# Altium project 18111A_Ticketing.PrjPcb
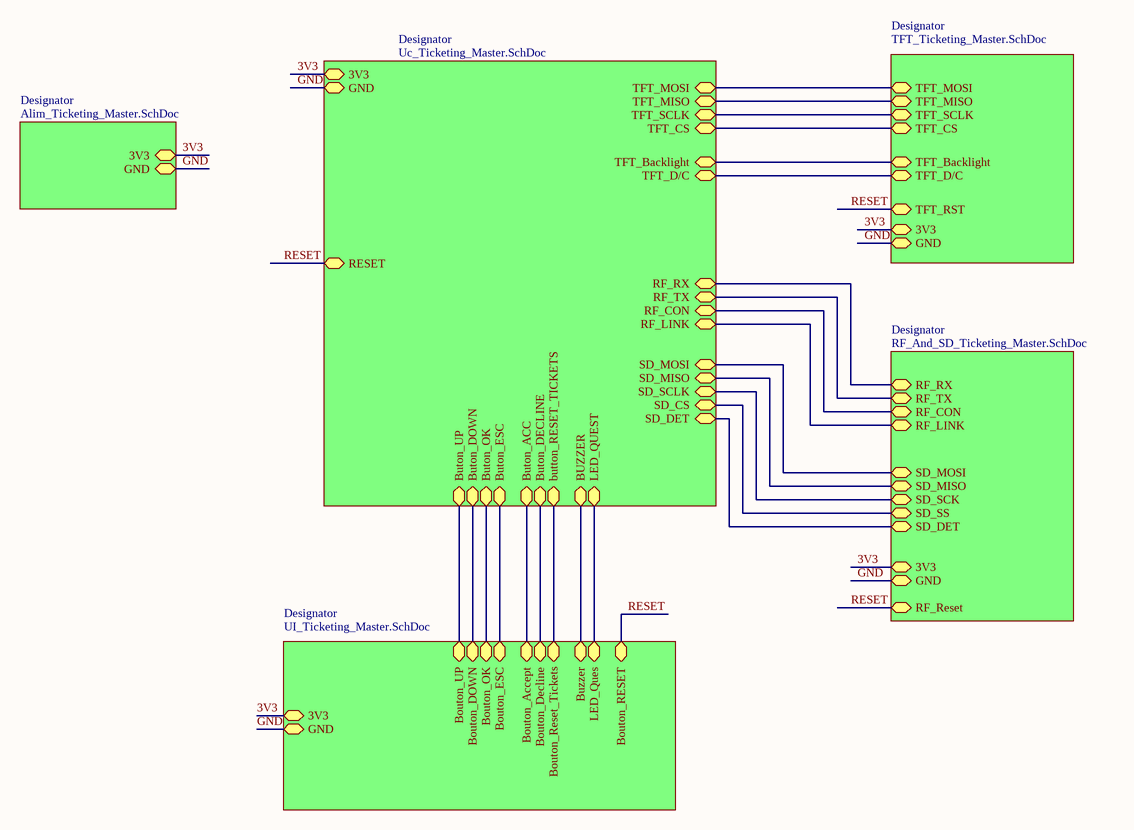
[diagram p0: Ticketing_Master.SchDoc]
6 sheets, 58 parts. Net scope: hierarchical (ports join the sheet entries above them; power ports are global).
Board file: PCB_Ticketing_Master.PcbDoc
Sheets:
  Ticketing_Master.SchDoc
    Designator = Alim_Ticketing_Master.SchDoc
    Designator = RF_And_SD_Ticketing_Master.SchDoc
    Designator = TFT_Ticketing_Master.SchDoc
    Designator = Uc_Ticketing_Master.SchDoc
    Designator = UI_Ticketing_Master.SchDoc

## Sheet Ticketing_Master.SchDoc
size A4; Organization: ETML-ES; Address1: Avenue Recordon 1; Address2: 1004 Lausanne; Address3: Switzerland

### Sub-sheets
Designator = Alim_Ticketing_Master.SchDoc: 3V3, GND
Designator = RF_And_SD_Ticketing_Master.SchDoc: RF_RX, RF_TX, SD_MISO, RF_Reset, SD_SS, SD_MOSI, SD_SCK, RF_CON, RF_LINK, GND, 3V3, SD_DET
Designator = TFT_Ticketing_Master.SchDoc: TFT_MOSI, TFT_Backlight, TFT_CS, TFT_RST, TFT_D/C, TFT_MISO, TFT_SCLK, 3V3, GND
Designator = Uc_Ticketing_Master.SchDoc: 3V3, GND, SD_SCLK, TFT_SCLK, SD_MOSI, SD_MISO, RF_RX, RF_TX, TFT_MOSI, TFT_MISO, TFT_Backlight, SD_CS, TFT_CS, TFT_D/C, RF_CON, RF_LINK, Buton_UP, Buton_OK, Buton_ESC, Buton_DOWN, LED_QUEST, BUZZER, Buton_DECLINE, button_RESET_TICKETS, Buton_ACC, RESET, SD_DET
Designator = UI_Ticketing_Master.SchDoc: GND, 3V3, Buzzer, Bouton_Accept, Bouton_UP, Bouton_OK, LED_Ques, Bouton_ESC, Bouton_Decline, Bouton_Reset_Tickets, Bouton_DOWN, Bouton_RESET

### Nets
3V3: sheet Designator/3V3, sheet Designator/3V3, sheet Designator/3V3, sheet Designator/3V3, sheet Designator/3V3
GND: sheet Designator/GND, sheet Designator/GND, sheet Designator/GND, sheet Designator/GND, sheet Designator/GND
BackLight: sheet Designator/TFT_Backlight, sheet Designator/TFT_Backlight
Connect(M): sheet Designator/RF_CON, sheet Designator/RF_CON
CS: sheet Designator/TFT_CS, sheet Designator/TFT_CS
D/C: sheet Designator/TFT_D/C, sheet Designator/TFT_D/C
LED_Ques: sheet Designator/LED_QUEST, sheet Designator/LED_Ques
LINK(M): sheet Designator/RF_LINK, sheet Designator/RF_LINK
MISO: sheet Designator/TFT_MISO, sheet Designator/TFT_MISO
MOSI: sheet Designator/TFT_MOSI, sheet Designator/TFT_MOSI
RESET: sheet Designator/RF_Reset, sheet Designator/TFT_RST, sheet Designator/RESET, sheet Designator/Bouton_RESET
SCLK: sheet Designator/TFT_SCLK, sheet Designator/TFT_SCLK
UART_RX: sheet Designator/RF_RX, sheet Designator/RF_RX
UART_TX: sheet Designator/RF_TX, sheet Designator/RF_TX
NetJ2_2: sheet Designator/SD_SS, sheet Designator/SD_CS
NetJ2_3: sheet Designator/SD_MOSI, sheet Designator/SD_MOSI
NetJ2_5: sheet Designator/SD_SCK, sheet Designator/SD_SCLK
NetJ2_7: sheet Designator/SD_MISO, sheet Designator/SD_MISO
NetJ2_9: sheet Designator/SD_DET, sheet Designator/SD_DET
NetQ1_1: sheet Designator/BUZZER, sheet Designator/Buzzer
NetR10_1: sheet Designator/Buton_OK, sheet Designator/Bouton_OK
NetR11_1: sheet Designator/Buton_UP, sheet Designator/Bouton_UP
NetR13_1: sheet Designator/Buton_ESC, sheet Designator/Bouton_ESC
NetR14_1: sheet Designator/Buton_DOWN, sheet Designator/Bouton_DOWN
NetR17_1: sheet Designator/Buton_ACC, sheet Designator/Bouton_Accept
NetR18_1: sheet Designator/Buton_DECLINE, sheet Designator/Bouton_Decline
NetR19_1: sheet Designator/button_RESET_TICKETS, sheet Designator/Bouton_Reset_Tickets

### Notes on the sheet
- Fichier :
- Date :
- Heure :
- Projet :
- Auteur :
- Version :
- Chemin :

## Sheet Alim_Ticketing_Master.SchDoc
size A4; Organization: ETML-ES; Address1: Avenue Recordon 1; Address2: 1004 Lausanne; Address3: Switzerland
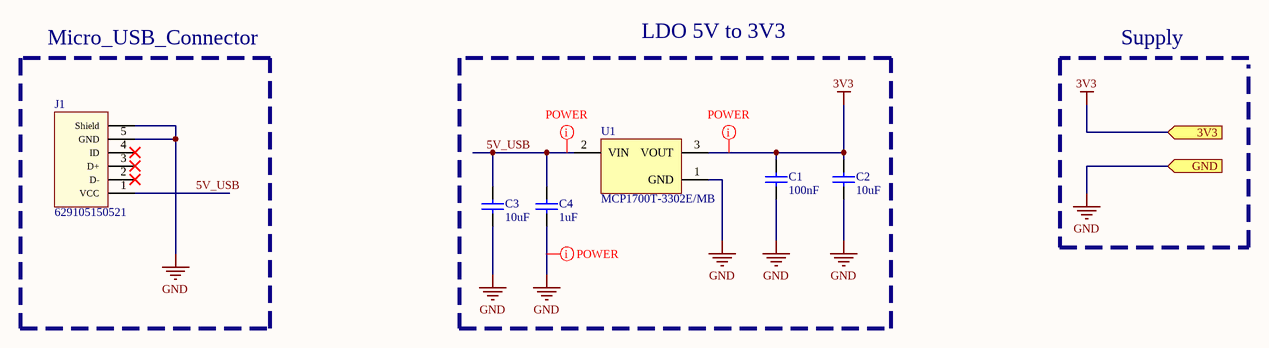
[diagram p1: Alim_Ticketing_Master.SchDoc]

### Parts
C1  100nF  [6-0805_N]
C2  10uF  [6-0805_N]
C3  10uF  [6-0805_N]
C4  1uF  [6-0805_N]
J1  629105150521  [629105150521]
U1  MCP1700T-3302E/MB  [SOT-89-MB3_M]

### Blocks framed on the sheet
Micro_USB_Connector: J1
LDO 5V to 3V3: C1-C4 U1

### Ports
3V3, GND

### Nets
3V3: C1.2 C2.2 U1.3(VOUT) ; port 3V3
GND: C1.1 C2.1 C3.1 C4.1 J1.5(GND) J1.Shell(Shield) U1.1(GND) ; port GND
5V_USB: C3.2 C4.2 J1.1(VCC) U1.2(VIN)

Not connected (* = marked no-connect by the designer): J1 2(D-)* 3(D+)* 4(ID)*

### Layout directives
net class POWER: 3V3, 5V_USB, GND

### Notes on the sheet
- Supply
- Fichier :
- Date :
- Heure :
- Projet :
- Auteur :
- Version :
- Chemin :

### Library data of the parts
C1 = CMP-1036-04401-1: CAP 100nF 16V ±10% 0805 (2012 Metric) Thickness 1.45mm SMD; Case-Metric: 2012; Case-EIA: 0805; Tolerance: Â±10%; Max Thickness: 1.45 mm; Technology: SMT; Value: 100nF; Rated Voltage: 16 V
C2-C4 = CMP-1036-04930-1: CAP 10uF 16V ±20% 0805 (2012 Metric) Thickness 1mm SMD; Case-Metric: 2012; Case-EIA: 0805; Tolerance: Â±20%; Value: 10uF; Rated Voltage: 16 V; Technology: SMT; Max Thickness: 1 mm
J1 = 629105150521: Micro USB 2.0 SMT Type B Horizontal 5 Contacts High Current WR-COM; Interface Type: Type B; Gender: Receptacle; ComponentLink1Description: Manufacturer; ComponentLink1URL: http://www.we-online.de; ComponentLink2Description: Datasheet; ComponentLink2URL: http://katalog.we-online.de/em/datasheet/629105150521.pdf; Part Number: 629105150521; Published Date: April 2017; Publisher: Wurth Elektronik; Sub-Family: Micro USB 2.0; Type: Horizontal; Construction: SMT
U1 = CMP-0136-00812-1: Low Quiescent Current LDO, 3-Pin SOT-89, Extended Temperature, Tape and Reel; PackageDescription: 3-Lead Plastic Small Outline Transistor Header (MB) [SOT-89]; PackageReference: SOT-89-MB3; DatasheetVersion: revB, Feb-2007; Code_IPC: SOT89; PackageVersion: revBB, Aug-2009

## Sheet RF_And_SD_Ticketing_Master.SchDoc
size A4; Organization: ETML-ES; Address1: Avenue Recordon 1; Address2: 1004 Lausanne; Address3: Switzerland
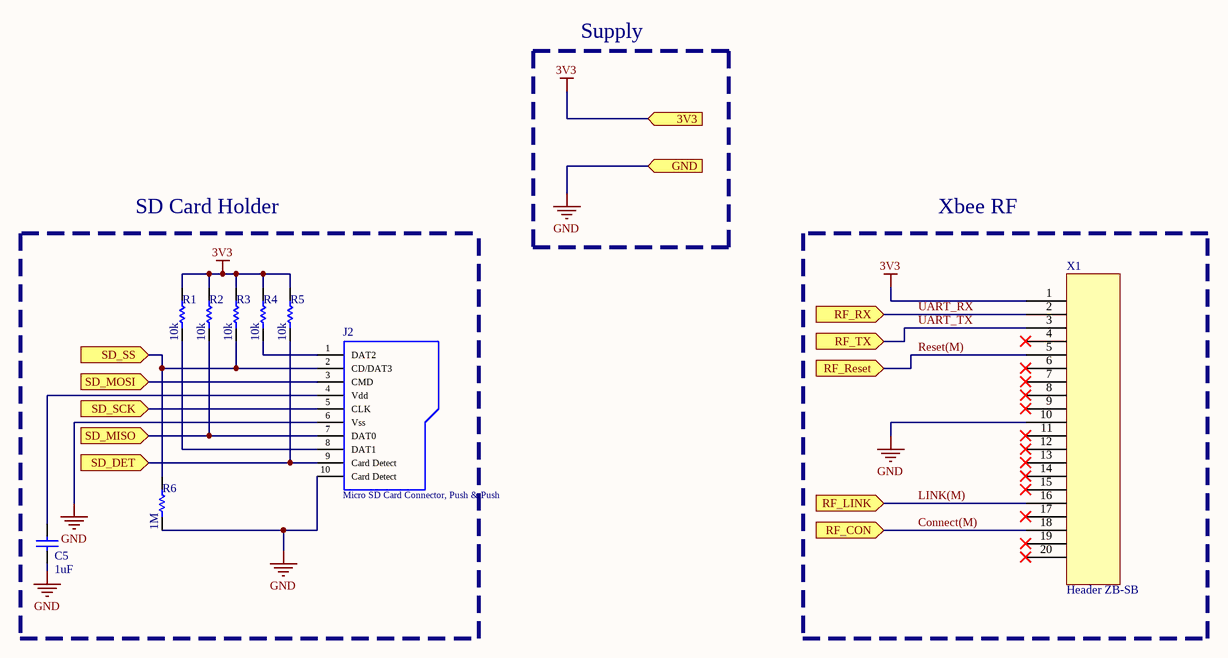
[diagram p2: RF_And_SD_Ticketing_Master.SchDoc]

### Parts
C5  1uF  [6-0805_N]
J2  Micro SD Card Connector, Push & Push  [693071010811]
R1  10k  [RESC0805(2012)_L]
R2  10k  [RESC0805(2012)_L]
R3  10k  [RESC0805(2012)_L]
R4  10k  [RESC0805(2012)_L]
R5  10k  [RESC0805(2012)_L]
R6  1M  [RESC0805(2012)_L]
X1  Header ZB-SB  [ZB-SB]

### Blocks framed on the sheet
Xbee RF: X1

### Ports
3V3, GND, RF_CON, RF_LINK, RF_Reset, RF_RX, RF_TX, SD_DET, SD_MISO, SD_MOSI, SD_SCK, SD_SS

### Nets
3V3: R1.2 R2.2 R3.2 R4.2 R5.2 X1.1 ; port 3V3
GND: C5.1 J2.6(Vss) J2.10(Card_Detect) R6.1 X1.10 ; port GND
Connect(M): X1.18 ; port RF_CON
LINK(M): X1.16 ; port RF_LINK
Reset(M): X1.5 ; port RF_Reset  [project net RESET]
UART_RX: X1.2 ; port RF_RX
UART_TX: X1.3 ; port RF_TX
NetC5_2: C5.2 J2.4(Vdd)
NetJ2_1: J2.1(DAT2) R4.1
NetJ2_2: J2.2(CD/DAT3) R3.1 R6.2 ; port SD_SS
NetJ2_3: J2.3(CMD) ; port SD_MOSI
NetJ2_5: J2.5(CLK) ; port SD_SCK
NetJ2_7: J2.7(DAT0) R2.1 ; port SD_MISO
NetJ2_8: J2.8(DAT1) R1.1
NetJ2_9: J2.9(Card_Detect) R5.1 ; port SD_DET

Not connected (* = marked no-connect by the designer): X1 4* 6* 7* 8* 9* 11* 12* 13* 14* 15* 17* 19* 20*

### Notes on the sheet
- Supply
- SD Card Holder
- Fichier :
- Date :
- Heure :
- Projet :
- Auteur :
- Version :
- Chemin :

### Library data of the parts
C5 = CMP-1036-04930-1: as C2 on sheet Alim_Ticketing_Master; Value: 10uF; Rated Voltage: 16 V; Technology: SMT; Max Thickness: 1 mm
J2 = 693071010811: WR-CRD Micro SD Card Connector, Push & Push, with card detection; Rated Current: 0.5A; Working Voltage: 500V AC; ComponentLink1Description: Manufacturer; ComponentLink1URL: http://www.we-online.de; ComponentLink2Description: Datasheet; ComponentLink2URL: http://katalog.we-online.de/em/datasheet/693071010811.pdf; Part Number: 693071010811; Published Date: Feb. 2018; Publisher: Wurth Elektronik; Operating Temperature: -25 to 85 degC; Mounting Technology: SMT
R1-R6 = CMP-1013-00122-1: 100K 0.125W 5% 0805 (2012 Metric)  SMD; Case-Metric: 2012; Case-EIA: 0805; Tolerance: 5 %; Technology: SMT; Power: 0.125 W
  R1-R5: Value: 10k
  R6: Value: 1M
X1 = HDR ZB-SB 2x10: Header 2x10; PackageCase: XBee; Value: 2x10

## Sheet TFT_Ticketing_Master.SchDoc
size A4; Organization: ETML-ES; Address1: Avenue Recordon 1; Address2: 1004 Lausanne; Address3: Switzerland
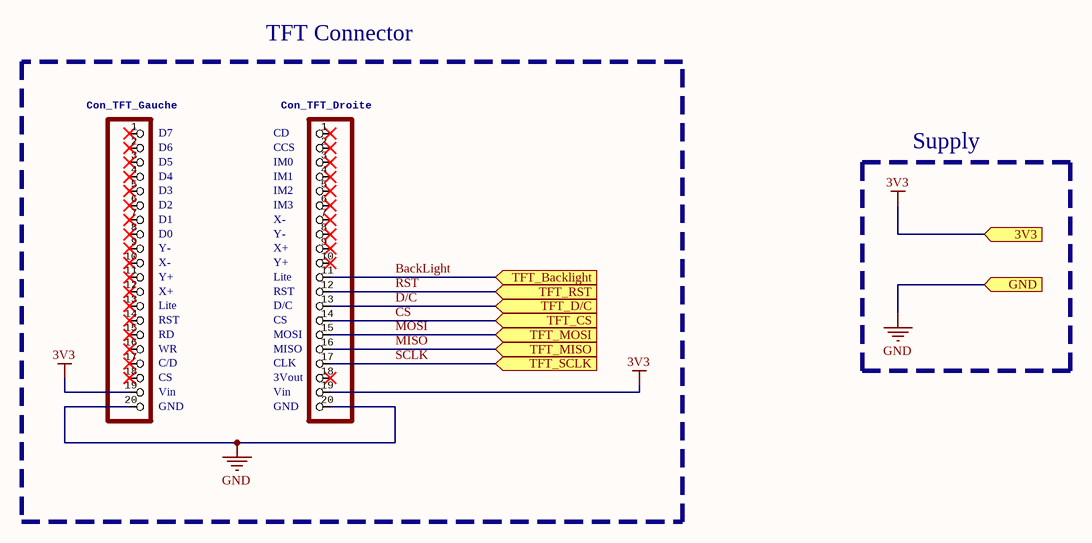
[diagram p3: TFT_Ticketing_Master.SchDoc]

### Parts
Con_TFT_Droite  HEADER-1X20ROUND  [HDR1X20]  (value not drawn)
Con_TFT_Gauche  HEADER-1X20ROUND  [HDR1X20]  (value not drawn)

### Blocks framed on the sheet
TFT Connector: Con_TFT_Droite Con_TFT_Gauche

### Ports
3V3, GND, TFT_Backlight, TFT_CS, TFT_D/C, TFT_MISO, TFT_MOSI, TFT_RST, TFT_SCLK

### Nets
3V3: Con_TFT_Droite.19 Con_TFT_Gauche.19 ; port 3V3
GND: Con_TFT_Droite.20 Con_TFT_Gauche.20 ; port GND
BackLight: Con_TFT_Droite.11 ; port TFT_Backlight
CS: Con_TFT_Droite.14 ; port TFT_CS
D/C: Con_TFT_Droite.13 ; port TFT_D/C
MISO: Con_TFT_Droite.16 ; port TFT_MISO
MOSI: Con_TFT_Droite.15 ; port TFT_MOSI
RST: Con_TFT_Droite.12 ; port TFT_RST  [project net RESET]
SCLK: Con_TFT_Droite.17 ; port TFT_SCLK

Not connected (* = marked no-connect by the designer): Con_TFT_Droite 1* 2* 3* 4* 5* 6* 7* 8* 9* 10* 18*; Con_TFT_Gauche 1* 2* 3* 4* 5* 6* 7* 8* 9* 10* 11* 12* 13* 14* 15* 16* 17* 18*

### Notes on the sheet
- (near Con_TFT_Gauche) D7
- (near Con_TFT_Gauche) D6
- (near Con_TFT_Gauche) D5
- (near Con_TFT_Gauche) D4
- (near Con_TFT_Droite) CD
- (near Con_TFT_Droite) CCS
- (near Con_TFT_Droite) IM0
- (near Con_TFT_Droite) IM1
- Supply
- (near Con_TFT_Gauche) D3
- (near Con_TFT_Gauche) D2
- (near Con_TFT_Gauche) D1
- (near Con_TFT_Gauche) D0
- (near Con_TFT_Gauche) Y-
- (near Con_TFT_Gauche) X-
- (near Con_TFT_Droite) IM2
- (near Con_TFT_Droite) IM3
- (near Con_TFT_Droite) X-
- (near Con_TFT_Droite) Y-
- (near Con_TFT_Droite) X+
- (near Con_TFT_Droite) Y+
- (near Con_TFT_Gauche) Y+
- (near Con_TFT_Gauche) X+
- (near Con_TFT_Gauche) Lite
- (near Con_TFT_Gauche) RST
- (near Con_TFT_Droite) Lite
- (near Con_TFT_Droite) RST
- (near Con_TFT_Droite) D/C
- (near Con_TFT_Droite) CS
- (near Con_TFT_Gauche) RD
- (near Con_TFT_Gauche) WR
- (near Con_TFT_Gauche) C/D
- (near Con_TFT_Gauche) CS
- (near Con_TFT_Gauche) Vin
- (near Con_TFT_Gauche) GND
- (near Con_TFT_Droite) MOSI
- (near Con_TFT_Droite) MISO
- (near Con_TFT_Droite) CLK
- (near Con_TFT_Droite) 3Vout
- (near Con_TFT_Droite) Vin
- (near Con_TFT_Droite) GND
- Fichier :
- Date :
- Heure :
- Projet :
- Auteur :
- Version :
- Chemin :

## Sheet Uc_Ticketing_Master.SchDoc
size A4; Organization: ETML-ES; Address1: Avenue Recordon 1; Address2: 1004 Lausanne; Address3: Switzerland
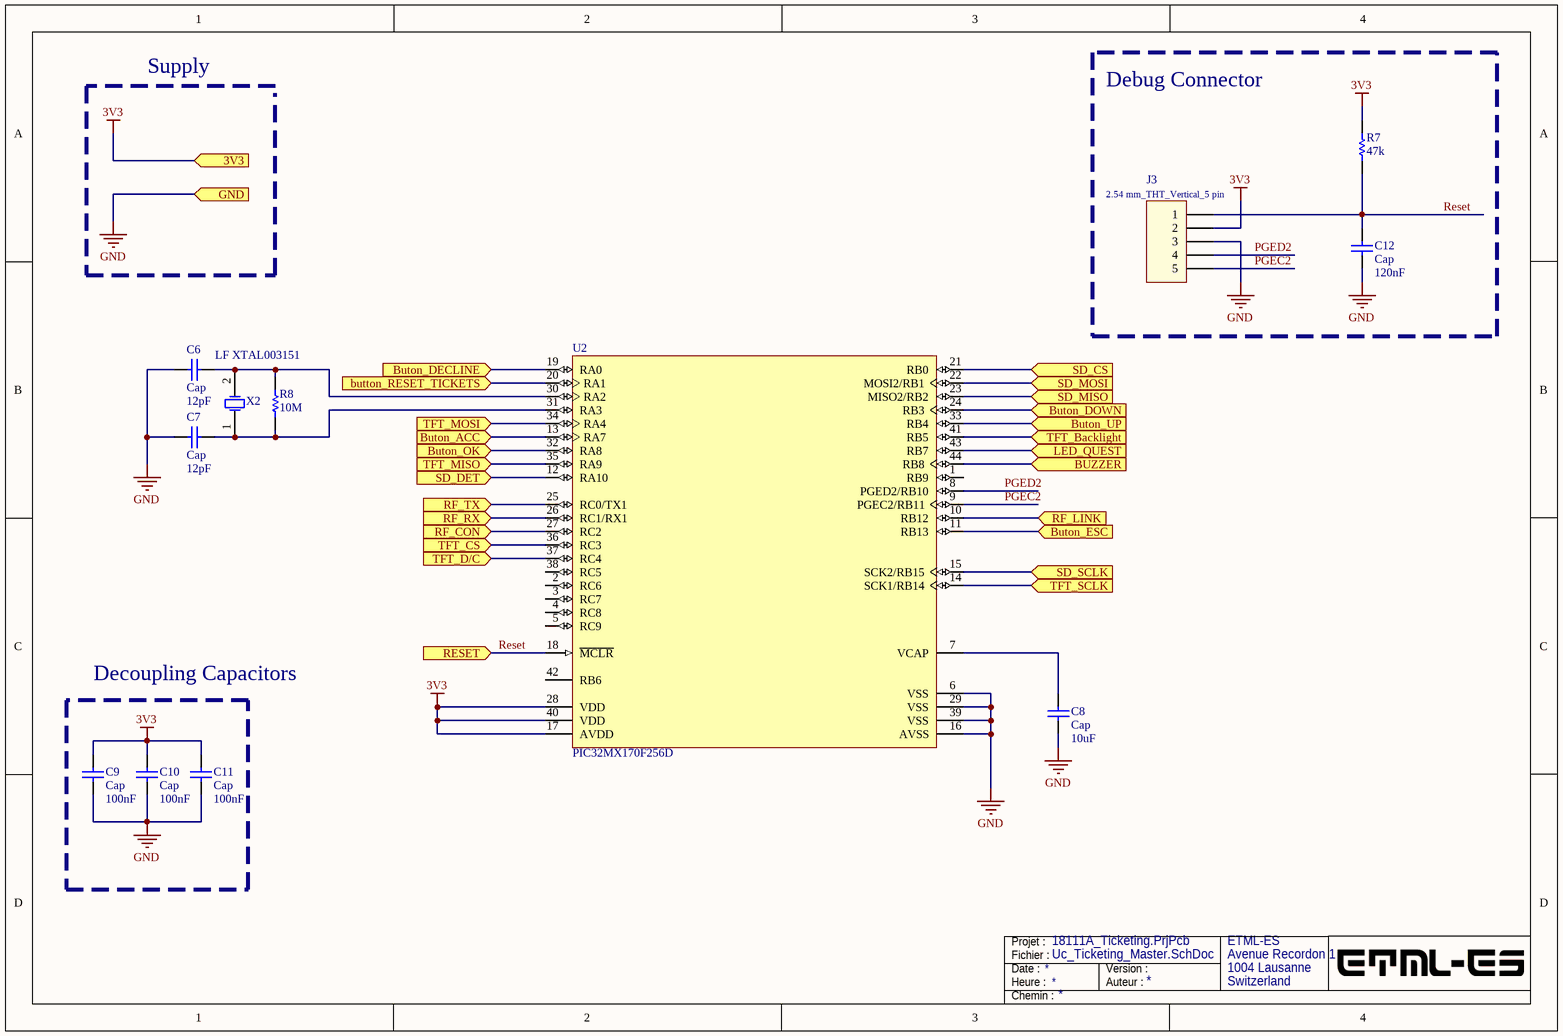
[diagram p4: Uc_Ticketing_Master.SchDoc]

### Parts
C6  Cap  value 12pF  [6-0805_N]
C7  Cap  value 12pF  [6-0805_N]
C8  Cap  value 10uF  [6-0805_N]
C9  Cap  value 100nF  [6-0805_N]
C10  Cap  value 100nF  [6-0805_N]
C11  Cap  value 100nF  [6-0805_N]
C12  Cap  value 120nF  [6-0805_N]
J3  2.54 mm_THT_Vertical_5 pin  [61300511121]
R7  47k  [RESC0805(2012)_L]
R8  10M  [RESC0805(2012)_L]
U2  PIC32MX170F256D  [MCHP-TQFP-PT44_N]
X2  LF XTAL003151  [ECS-80-18-5PX-TR_V]

### Blocks framed on the sheet
Debug Connector: C12 J3 R7
Decoupling Capacitors: C9-C11

### Ports
3V3, Buton_ACC, Buton_DECLINE, Buton_DOWN, Buton_ESC, Buton_OK, Buton_UP, button_RESET_TICKETS, BUZZER, GND, LED_QUEST, RESET, RF_CON, RF_LINK, RF_RX, RF_TX, SD_CS, SD_DET, SD_MISO, SD_MOSI, SD_SCLK, TFT_Backlight, TFT_CS, TFT_D/C, TFT_MISO, TFT_MOSI, TFT_SCLK

### Nets
3V3: C9.2 C10.2 C11.2 J3.2 R7.1 U2.17(AVDD) U2.28(VDD) U2.40(VDD) ; port 3V3
GND: C6.1 C7.2 C8.1 C9.1 C10.1 C11.1 C12.1 J3.3 U2.6(VSS) U2.16(AVSS) U2.29(VSS) U2.39(VSS) ; port GND
BackLight: U2.41(RB5) ; port TFT_Backlight
Connect(M): U2.27(RC2) ; port RF_CON
CS: U2.36(RC3) ; port TFT_CS
D/C: U2.37(RC4) ; port TFT_D/C
LED_Ques: U2.43(RB7) ; port LED_QUEST
LINK(M): U2.10(RB12) ; port RF_LINK
MISO: U2.35(RA9) ; port TFT_MISO
MOSI: U2.34(RA4) ; port TFT_MOSI
PGEC2: J3.5 U2.9(PGEC2/RB11)
PGED2: J3.4 U2.8(PGED2/RB10)
RESET: C12.2 J3.1 R7.2 U2.18(~{MCLR}) ; port RESET
SCLK: U2.14(SCK1/RB14) ; port TFT_SCLK
UART_RX: U2.26(RC1/RX1) ; port RF_RX
UART_TX: U2.25(RC0/TX1) ; port RF_TX
NetC6_2: C6.2 R8.2 U2.30(RA2) X2.2(X2)
NetC7_1: C7.1 R8.1 U2.31(RA3) X2.1(X1)
NetC8_2: C8.2 U2.7(VCAP)
NetJ2_2: U2.21(RB0) ; port SD_CS
NetJ2_3: U2.22(MOSI2/RB1) ; port SD_MOSI
NetJ2_5: U2.15(SCK2/RB15) ; port SD_SCLK
NetJ2_7: U2.23(MISO2/RB2) ; port SD_MISO
NetJ2_9: U2.12(RA10) ; port SD_DET
NetQ1_1: U2.44(RB8) ; port BUZZER
NetR10_1: U2.32(RA8) ; port Buton_OK
NetR11_1: U2.33(RB4) ; port Buton_UP
NetR13_1: U2.11(RB13) ; port Buton_ESC
NetR14_1: U2.24(RB3) ; port Buton_DOWN
NetR17_1: U2.13(RA7) ; port Buton_ACC
NetR18_1: U2.19(RA0) ; port Buton_DECLINE
NetR19_1: U2.20(RA1) ; port button_RESET_TICKETS

Not connected (* = marked no-connect by the designer): U2 1(RB9) 2(RC6) 3(RC7) 4(RC8) 5(RC9) 38(RC5) 42(RB6)

### Notes on the sheet
- Supply
- Fichier :
- Date :
- Heure :
- Projet :
- Auteur :
- Version :
- Chemin :

### Library data of the parts
C6-C12 = Cap: Capacitor; Published: 8-Jun-2000; LatestRevisionDate: 17-Jul-2002; LatestRevisionNote: Re-released for DXP Platform.; PackageReference: RAD-0.3; Publisher: Altium Limited; PackageDescription: Radial Cap, Thru-Hole; 2 Leads; 0.3 in Pin Spacing
J3 = 61300511121: Pin Header WR-PHD, pitch 2.54 mm, THT, Vertical, single row, 5 pin; Rated Current: 3 A; Pin Number: 5; Pitch: 2.54 mm; Working Voltage: 250 VAC; Contact Resistance: 20 mOhm; Insulation Resistance: >1000 MOhm; ComponentLink1Description: Manufacturer; ComponentLink1URL: http://www.we-online.de; ComponentLink2Description: Datasheet; ComponentLink2URL: http://katalog.we-online.de/em/datasheet/6130xx11121.pdf; Part Number: 61300511121; Published Date: Jan. 2018; Publisher: Wurth Elektronik; Operating Temperature: -40 to 105 degC; Mounting Technology: THT; Row Number: Single; Orientation: Vertical
R7 = CMP-1013-00122-1: as R1 on sheet RF_And_SD_Ticketing_Master; Tolerance: 5 %; Technology: SMT; Value: 47k; Power: 0.125 W
R8 = CMP-1013-00122-1: 100K 0.125W 5% 0805 (2012 Metric)  SMD; Case-Metric: 2012; Value: 47k; Case-EIA: 0805; Tolerance: 5 %; Technology: SMT; Power: 0.125 W
U2 = MCHP-PIC32MX2XXFXXXD-TQFP-44
X2 = CMP-2000-06193-1: Low Profile Quartz Crystal, 8.0 MHz, 2-Pin SMD, RoHS, Tape and Reel; Brand: ECS; Tolerance: 30PPM; Case Height: 4.3mm; Frequency: 8MHz; Frequency Stability: 50PPM; Case Length: 13.2mm; Case Width: 4.8mm; Load Capacitance: 18pF; Termination Style: SMD/SMT; Product Category: Crystals; Packaging: Reel; Package Reference: ECS-80-18-5PX-TR; Mounting Technology: SurfaceMount; Dimensions: 4.8mmWx13.2mmLx4.3mmH; Package Description: 2-Pin Surface Mount Device, Body 11.4 x 4.8 mm, Height 4.3 mm; Datasheet URL: https://www.ecsxtal.com/store/pdf/csm-7x.pdf; Datasheet Version: 05/2016; Manufacturer: ECS; Factory Pack Quantity: 1000; Manufacturer URL: https://www.ecsxtal.com/; Type: SMDQuartzCrystals; Mounting Style: SMD/SMT; Package / Case: HC-49/US; Operating Temperature Range: -10Cto+70C; RoHS: Details; Series: CSM-7X

## Sheet UI_Ticketing_Master.SchDoc
size A4; Organization: ETML-ES; Address1: Avenue Recordon 1; Address2: 1004 Lausanne; Address3: Switzerland
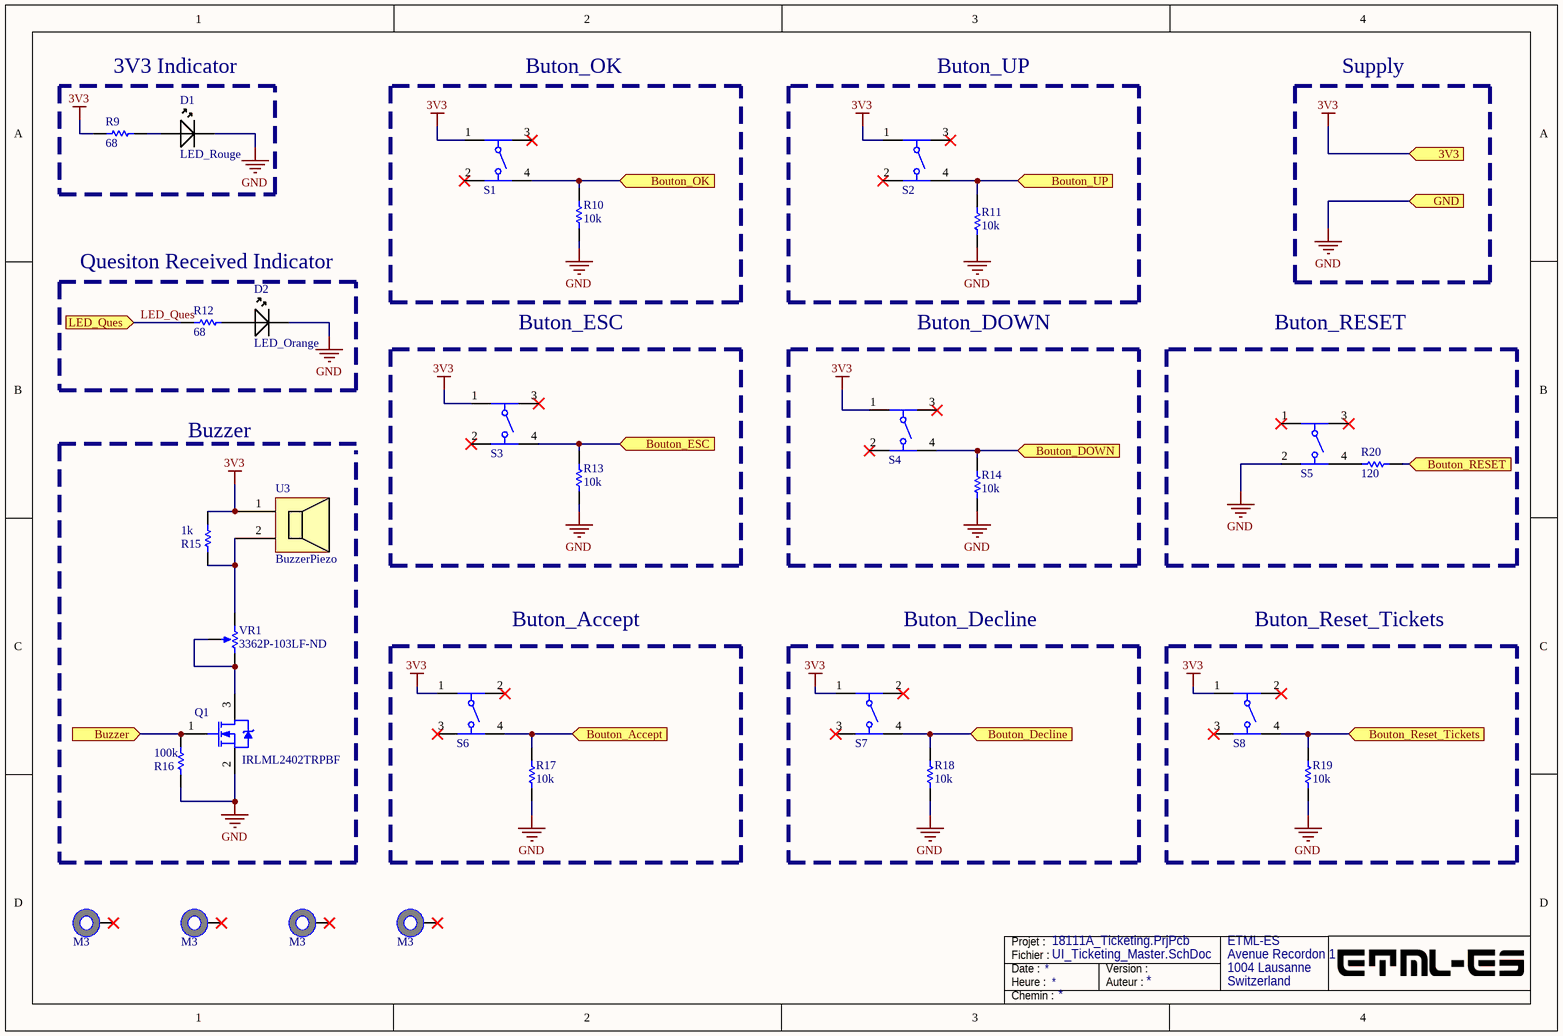
[diagram p5: UI_Ticketing_Master.SchDoc]

### Parts
(Parts that share a designator on the sheet are numbered #1, #2 ... from top to bottom, then left to right.)
#1  M3  [9774010151]
#2  M3  [9774010151]
#3  M3  [9774010151]
#4  M3  [9774010151]
D1  LED_Rouge  [LED-2P-2.28-3MM]
D2  LED_Orange  [Type 5mm]
Q1  IRLML2402TRPBF  [INTR-IRLML2402TRPBF-3_V]
R9  68  [RESC0805(2012)_L]
R10  10k  [RESC0805(2012)_L]
R11  10k  [RESC0805(2012)_L]
R12  68  [RESC0805(2012)_L]
R13  10k  [RESC0805(2012)_L]
R14  10k  [RESC0805(2012)_L]
R15  1k  [RESC2013X60X35ML10T20]
R16  100k  [RESC2013X60X35ML10T20]
R17  10k  [RESC0805(2012)_L]
R18  10k  [RESC0805(2012)_L]
R19  10k  [RESC0805(2012)_L]
R20  120  [RESC0805(2012)_L]
S1  430152095826  [430152095826]  (value not drawn)
S2  430152095826  [430152095826]  (value not drawn)
S3  430152095826  [430152095826]  (value not drawn)
S4  430152095826  [430152095826]  (value not drawn)
S5  430182050816  [430182050816]  (value not drawn)
S6  430466073726  [4304x60737x6_12x12x7.3]  (value not drawn)
S7  430466073726  [4304x60737x6_12x12x7.3]  (value not drawn)
S8  430466073726  [4304x60737x6_12x12x7.3]  (value not drawn)
U3  BuzzerPiezo  [Buzzer]
VR1  3362P-103LF-ND  [BOUR-3362P]

### Blocks framed on the sheet
3V3 Indicator: D1 R9
Buton_OK: R10 S1
Buton_UP: R11 S2
Quesiton Received Indicator: D2 R12
Buton_ESC: R13 S3
Buton_DOWN: R14 S4
Buton_RESET: R20 S5
Buton_Accept: R17 S6
Buton_Decline: R18 S7
Buton_Reset_Tickets: R19 S8

### Ports
3V3, Bouton_Accept, Bouton_Decline, Bouton_DOWN, Bouton_ESC, Bouton_OK, Bouton_RESET, Bouton_Reset_Tickets, Bouton_UP, Buzzer, GND, LED_Ques

### Nets
3V3: R9.2 R15.2 S1.1 S2.1 S3.1 S4.1 S6.1 S7.1 S8.1 U3.1 ; port 3V3
GND: D1.2(Cathode) D2.1(Cathode) Q1.2(S) R10.2 R11.2 R13.2 R14.2 R16.1 R17.2 R18.2 R19.2 S5.2 ; port GND
LED_Ques: R12.2 ; port LED_Ques
RESET: R20.2 ; port Bouton_RESET
NetD1_1: D1.1(Anode) R9.1
NetD2_2: D2.2(Anode) R12.1
NetQ1_1: Q1.1(G) R16.2 ; port Buzzer
NetQ1_3: Q1.3(D) VR1.2(S) VR1.3(CW)
NetR10_1: R10.1 S1.4 ; port Bouton_OK
NetR11_1: R11.1 S2.4 ; port Bouton_UP
NetR13_1: R13.1 S3.4 ; port Bouton_ESC
NetR14_1: R14.1 S4.4 ; port Bouton_DOWN
NetR15_1: R15.1 U3.2 VR1.1(CCW)
NetR17_1: R17.1 S6.4 ; port Bouton_Accept
NetR18_1: R18.1 S7.4 ; port Bouton_Decline
NetR19_1: R19.1 S8.4 ; port Bouton_Reset_Tickets
NetR20_1: R20.1 S5.4

Not connected (* = marked no-connect by the designer): #1 1*; #2 1*; #3 1*; #4 1*; S1 2* 3*; S2 2* 3*; S3 2* 3*; S4 2* 3*; S5 1* 3*; S6 2* 3*; S7 2* 3*; S8 2* 3*

### Notes on the sheet
- Supply
- Buzzer
- Fichier :
- Date :
- Heure :
- Projet :
- Auteur :
- Version :
- Chemin :

### Library data of the parts
#1-#4 = 9774010151: WA-SMSI SMT Steel Spacer, M2.5 Thread Internal, Length 1mm; InnerDiameter: 3.5mm; OuterDiameter: 5.1mm
D1 D2 = LED: Supplier A: *; Supplier B: *; Supplier B Ref: *; Manufacturer URL: *; Manufacturer Ref: *; Package: *
  D1: Supplier A Ref: 754-1305-ND
  D2: Supplier A Ref: 754-1271-ND
Q1 = CMP-2000-05155-1: HEXFET(R) Power MOSFET, N-Channel, 20 V, 1.2 A, 3-Pin SOT-23, RoHS, Tape and Reel; Manufacturer: Infineon Technologies; PartNumber: IRLML2402TRBF; PackageCase: SOT-23; Supplier: Digi-key; Supplier PN: IRLML2402PBFCT-ND
R9-R14 R17-R19 = CMP-1013-00122-1: as R1 on sheet RF_And_SD_Ticketing_Master; Tolerance: 5 %; Technology: SMT; Power: 0.125 W
  R9 R12: Value: 68
  R10 R11 R13 R14 R17-R19: Value: 10k
R15 = CMP-2100-03671-1: Chip Resistor, 1 KOhm, +/- 1%, 125 mW, -55 to 155 degC, 0805 (2012 Metric), RoHS, Tape and Reel; Voltage Rating: 150V; Value: 1kOhm; PackageCase: 0805
R16 = CMP-2100-03671-1: Chip Resistor, 100 KOhm, +/- 1%, 125 mW, -55 to 155 degC, 0805 (2012 Metric), RoHS, Tape and Reel; Voltage Rating: 150V; PackageCase: 0805; Value: 100k
R20 = CMP-1013-00122-1: 100K 0.125W 5% 0805 (2012 Metric)  SMD; Case-Metric: 2012; Value: 10k; Case-EIA: 0805; Tolerance: 5 %; Technology: SMT; Power: 0.125 W
S1-S4 = 430152095826: 6x6mm SMD Tact Switch WS-TASV, height 9.5 mm, 260 gf; Rated Current: 50 mA; Operation Force: 260 gf; Rated Voltage: 12 VDC; ComponentLink1Description: Manufacturer; ComponentLink1URL: http://www.we-online.de; ComponentLink2Description: Datasheet; ComponentLink2URL: http://katalog.we-online.de/em/datasheet/4301x2xxx8x6.pdf; Part Number: 430152095826; Published Date: Nov. 2017; Publisher: Wurth Elektronik; Life Cycle: 200000; Operating Temperature: -40 to +85 degC; Size: 6x6x9.5 mm
S5 = 430182050816: 6x6mm SMD Tact Switch WS-TASV, height 5 mm, 160 gf; Rated Current: 50 mA; Operation Force: 160 gf; Rated Voltage: 12 VDC; ComponentLink1Description: Manufacturer; ComponentLink1URL: http://www.we-online.de; ComponentLink2Description: Datasheet; ComponentLink2URL: http://katalog.we-online.de/em/datasheet/4301x2xxx8x6.pdf; Part Number: 430182050816; Published Date: Nov. 2017; Publisher: Wurth Elektronik; Life Cycle: 1000000; Operating Temperature: -40 to +85 degC; Size: 6x6x5 mm
S6-S8 = 430466073726: WS-TATV 12x12mm washable Tact Switch, THT version; Operation Force: 260g; ComponentLink1Description: Manufacturer; ComponentLink1URL: http://www.we-online.de; ComponentLink2Description: Datasheet; ComponentLink2URL: http://katalog.we-online.de/em/datasheet/4304x60737x6.pdf; Part Number: 430466073726; Published Date: June 2017; Publisher: Wurth Elektronik; Size: 12x12x7.3 mm; Life Cycle: 300000 cycles
U3 = BZR: Buzzer 12mm piezo; Manufacturer: TDK Corporation
VR1 = CMP-1747-00003-1: Square Trimpot(R) Trimming Potentiometer, 100 KOhm, 300 V, -55 to 125 degC, 3-Pin THD, RoHS, Tube; Voltage Rating: 250 V; Case\Package: Axial; Tolerance: 1%; Power Rating: 250 mW; Resistance: 1 mohm; RoHSCompliant: true; ComponentLink2URL: http://www.bourns.com/docs/Product-Datasheets/3362.pdf; ComponentLink1Description: Manufacturer URL; DatasheetVersion: May-16; Package Quantity: 200; ComponentLink2Description: Datasheet; Min Operating Temperature: -55 degC; Mount: Through Hole; PackageDescription: 3-Pin Through Hole Device, Body 6.6 x 6.99 mm, Pitch 2.54 mm; Length: 0.248 inch; ComponentLink1URL: http://www.bourns.com/; PackageReference: 3326P; Max Operating Temperature: 155 degC; Packaging: Bulk

## Nets that join several sheets
3V3: Alim_Ticketing_Master (C1.2 C2.2 U1.3), RF_And_SD_Ticketing_Master (6 pins), TFT_Ticketing_Master (Con_TFT_Droite.19 Con_TFT_Gauche.19), Uc_Ticketing_Master (8 pins), UI_Ticketing_Master (10 pins)
GND: Alim_Ticketing_Master (7 pins), RF_And_SD_Ticketing_Master (5 pins), TFT_Ticketing_Master (Con_TFT_Droite.20 Con_TFT_Gauche.20), Uc_Ticketing_Master (12 pins), UI_Ticketing_Master (12 pins)
BackLight: TFT_Ticketing_Master (Con_TFT_Droite.11), Uc_Ticketing_Master (U2.41)
Connect(M): RF_And_SD_Ticketing_Master (X1.18), Uc_Ticketing_Master (U2.27)
CS: TFT_Ticketing_Master (Con_TFT_Droite.14), Uc_Ticketing_Master (U2.36)
D/C: TFT_Ticketing_Master (Con_TFT_Droite.13), Uc_Ticketing_Master (U2.37)
LED_Ques: Uc_Ticketing_Master (U2.43), UI_Ticketing_Master (R12.2)
LINK(M): RF_And_SD_Ticketing_Master (X1.16), Uc_Ticketing_Master (U2.10)
MISO: TFT_Ticketing_Master (Con_TFT_Droite.16), Uc_Ticketing_Master (U2.35)
MOSI: TFT_Ticketing_Master (Con_TFT_Droite.15), Uc_Ticketing_Master (U2.34)
NetJ2_2: RF_And_SD_Ticketing_Master (J2.2 R3.1 R6.2), Uc_Ticketing_Master (U2.21)
NetJ2_3: RF_And_SD_Ticketing_Master (J2.3), Uc_Ticketing_Master (U2.22)
NetJ2_5: RF_And_SD_Ticketing_Master (J2.5), Uc_Ticketing_Master (U2.15)
NetJ2_7: RF_And_SD_Ticketing_Master (J2.7 R2.1), Uc_Ticketing_Master (U2.23)
NetJ2_9: RF_And_SD_Ticketing_Master (J2.9 R5.1), Uc_Ticketing_Master (U2.12)
NetQ1_1: Uc_Ticketing_Master (U2.44), UI_Ticketing_Master (Q1.1 R16.2)
NetR10_1: Uc_Ticketing_Master (U2.32), UI_Ticketing_Master (R10.1 S1.4)
NetR11_1: Uc_Ticketing_Master (U2.33), UI_Ticketing_Master (R11.1 S2.4)
NetR13_1: Uc_Ticketing_Master (U2.11), UI_Ticketing_Master (R13.1 S3.4)
NetR14_1: Uc_Ticketing_Master (U2.24), UI_Ticketing_Master (R14.1 S4.4)
NetR17_1: Uc_Ticketing_Master (U2.13), UI_Ticketing_Master (R17.1 S6.4)
NetR18_1: Uc_Ticketing_Master (U2.19), UI_Ticketing_Master (R18.1 S7.4)
NetR19_1: Uc_Ticketing_Master (U2.20), UI_Ticketing_Master (R19.1 S8.4)
RESET: RF_And_SD_Ticketing_Master (X1.5), TFT_Ticketing_Master (Con_TFT_Droite.12), Uc_Ticketing_Master (C12.2 J3.1 R7.2 U2.18), UI_Ticketing_Master (R20.2)
SCLK: TFT_Ticketing_Master (Con_TFT_Droite.17), Uc_Ticketing_Master (U2.14)
UART_RX: RF_And_SD_Ticketing_Master (X1.2), Uc_Ticketing_Master (U2.26)
UART_TX: RF_And_SD_Ticketing_Master (X1.3), Uc_Ticketing_Master (U2.25)